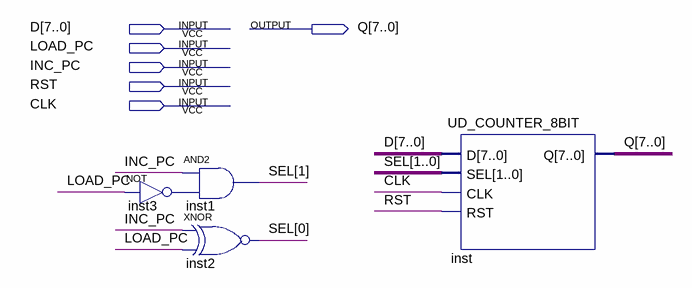
[diagram p0: schematic sheet]
// Quartus schematic PC.bdf as structural Verilog: 4 symbols, 6 pins
module PC (
  input  [7:0] D,
  input  LOAD_PC,
  input  INC_PC,
  input  RST,
  input  CLK,
  output [7:0] Q
);

  wire inst3_out;
  wire [1:0] SEL;

  not inst3 (inst3_out, LOAD_PC);
  and inst1 (SEL[1], INC_PC, inst3_out);
  xnor inst2 (SEL[0], INC_PC, LOAD_PC);
  UD_COUNTER_8BIT inst (.D(D), .SEL(SEL), .CLK(CLK), .RST(RST), .Q(Q));
endmodule
